# Altium project TeachEE.PrjPcb (part 2 of 2)

## Sheet ADC.SchDoc
size A4; SheetNumber: 7; SheetTotal: 9
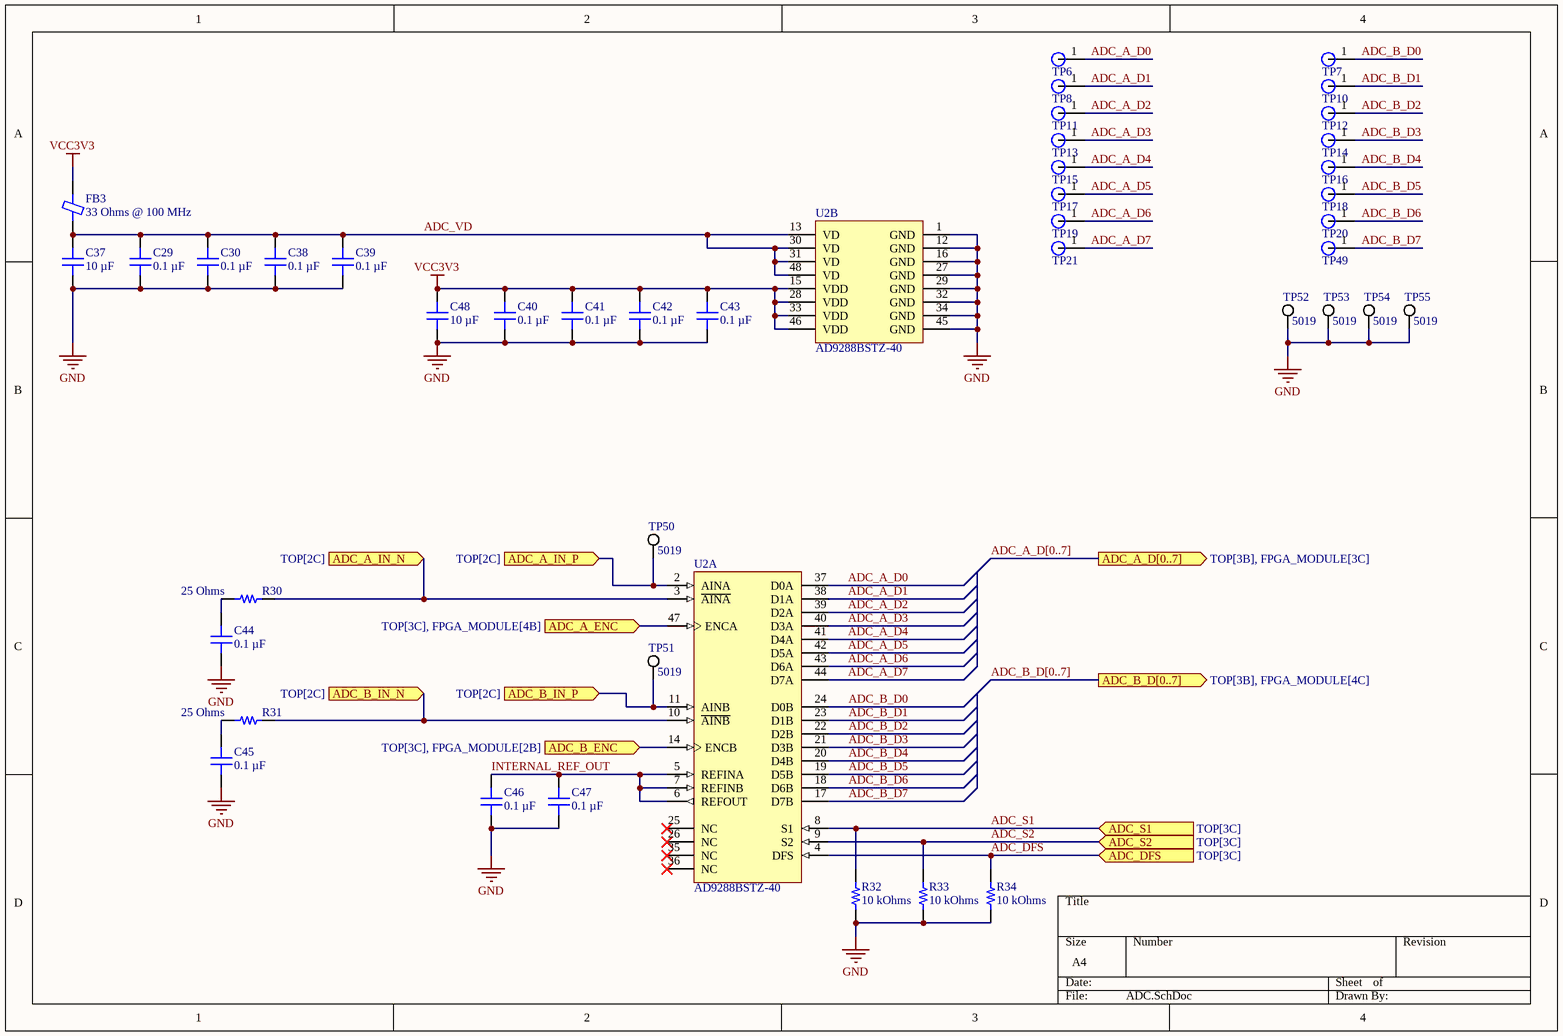
[diagram p4: ADC.SchDoc]

### Parts
C29  0.1 µF  [CAP 0402_1005]
C30  0.1 µF  [CAP 0402_1005]
C37  10 µF  [CAP 0402_1005]
C38  0.1 µF  [CAP 0402_1005]
C39  0.1 µF  [CAP 0402_1005]
C40  0.1 µF  [CAP 0402_1005]
C41  0.1 µF  [CAP 0402_1005]
C42  0.1 µF  [CAP 0402_1005]
C43  0.1 µF  [CAP 0402_1005]
C44  0.1 µF  [CAP 0402_1005]
C45  0.1 µF  [CAP 0402_1005]
C46  0.1 µF  [CAP 0402_1005]
C47  0.1 µF  [CAP 0402_1005]
C48  10 µF  [CAP 0402_1005]
FB3  33 Ohms @ 100 MHz  [FER 0201_0603]
R30  25 Ohms  [RES 0402_1005]
R31  25 Ohms  [RES 0402_1005]
R32  10 kOhms  [RES 0402_1005]
R33  10 kOhms  [RES 0402_1005]
R34  10 kOhms  [RES 0402_1005]
TP6  Test Point  [TP1]  (value not drawn)  (no BOM)
TP7  Test Point  [TP1]  (value not drawn)  (no BOM)
TP8  Test Point  [TP1]  (value not drawn)  (no BOM)
TP10  Test Point  [TP1]  (value not drawn)  (no BOM)
TP11  Test Point  [TP1]  (value not drawn)  (no BOM)
TP12  Test Point  [TP1]  (value not drawn)  (no BOM)
TP13  Test Point  [TP1]  (value not drawn)  (no BOM)
TP14  Test Point  [TP1]  (value not drawn)  (no BOM)
TP15  Test Point  [TP1]  (value not drawn)  (no BOM)
TP16  Test Point  [TP1]  (value not drawn)  (no BOM)
TP17  Test Point  [TP1]  (value not drawn)  (no BOM)
TP18  Test Point  [TP1]  (value not drawn)  (no BOM)
TP19  Test Point  [TP1]  (value not drawn)  (no BOM)
TP20  Test Point  [TP1]  (value not drawn)  (no BOM)
TP21  Test Point  [TP1]  (value not drawn)  (no BOM)
TP49  Test Point  [TP1]  (value not drawn)  (no BOM)
TP50  5019  [KSTN-5019_V]
TP51  5019  [KSTN-5019_V]
TP52  5019  [KSTN-5019_V]
TP53  5019  [KSTN-5019_V]
TP54  5019  [KSTN-5019_V]
TP55  5019  [KSTN-5019_V]
U2  AD9288BSTZ-40  [ST-48_M]  (parts A,B of 2)

### Ports
ADC_A_D[0..7] (out, see TOP[3B], FPGA_MODULE[3C]), ADC_A_ENC (in, see TOP[3C], FPGA_MODULE[4B]), ADC_A_IN_N (in, see TOP[2C]), ADC_A_IN_P (in, see TOP[2C]), ADC_B_D[0..7] (out, see TOP[3B], FPGA_MODULE[4C]), ADC_B_ENC (in, see TOP[3C], FPGA_MODULE[2B]), ADC_B_IN_N (in, see TOP[2C]), ADC_B_IN_P (in, see TOP[2C]), ADC_DFS (in, see TOP[3C]), ADC_S1 (in, see TOP[3C]), ADC_S2 (in, see TOP[3C])

### Nets
GND: C29.1 C30.1 C37.1 C38.1 C39.1 C40.1 C41.1 C42.1 C43.1 C44.1 C45.1 C46.1 C47.1 C48.1 R32.1 R33.1 R34.1 TP52.1 TP53.1 TP54.1 TP55.1 U2.1(GND) U2.12(GND) U2.16(GND) U2.27(GND) U2.29(GND) U2.32(GND) U2.34(GND) U2.45(GND)
VCC3V3: C40.2 C41.2 C42.2 C43.2 C48.2 FB3.1 U2.15(VDD) U2.28(VDD) U2.33(VDD) U2.46(VDD)
ADC_A_D0: TP6.1 U2.37(D0A)
ADC_A_D1: TP8.1 U2.38(D1A)
ADC_A_D2: TP11.1 U2.39(D2A)
ADC_A_D3: TP13.1 U2.40(D3A)
ADC_A_D4: TP15.1 U2.41(D4A)
ADC_A_D5: TP17.1 U2.42(D5A)
ADC_A_D6: TP19.1 U2.43(D6A)
ADC_A_D7: TP21.1 U2.44(D7A)
ADC_A_ENC: U2.47(ENCA) ; port ADC_A_ENC
ADC_A_IN_N: R30.2 U2.3(~{AINA}) ; port ADC_A_IN_N
ADC_A_IN_P: TP50.1 U2.2(AINA) ; port ADC_A_IN_P
ADC_B_D0: TP7.1 U2.24(D0B)
ADC_B_D1: TP10.1 U2.23(D1B)
ADC_B_D2: TP12.1 U2.22(D2B)
ADC_B_D3: TP14.1 U2.21(D3B)
ADC_B_D4: TP16.1 U2.20(D4B)
ADC_B_D5: TP18.1 U2.19(D5B)
ADC_B_D6: TP20.1 U2.18(D6B)
ADC_B_D7: TP49.1 U2.17(D7B)
ADC_B_ENC: U2.14(ENCB) ; port ADC_B_ENC
ADC_B_IN_N: R31.2 U2.10(~{AINB}) ; port ADC_B_IN_N
ADC_B_IN_P: TP51.1 U2.11(AINB) ; port ADC_B_IN_P
ADC_DFS: R34.2 U2.4(DFS) ; port ADC_DFS
ADC_S1: R32.2 U2.8(S1) ; port ADC_S1
ADC_S2: R33.2 U2.9(S2) ; port ADC_S2
ADC_VD: C29.2 C30.2 C37.2 C38.2 C39.2 FB3.2 U2.13(VD) U2.30(VD) U2.31(VD) U2.48(VD)
INTERNAL_REF_OUT: C46.2 C47.2 U2.5(REFINA) U2.6(REFOUT) U2.7(REFINB)
NetC44_2: C44.2 R30.1
NetC45_2: C45.2 R31.1

Not connected (* = marked no-connect by the designer): U2 25(NC)* 26(NC)* 35(NC)* 36(NC)*

### Buses and harness runs
bus ADC_A_D[0..7] = port ADC_A_D[0..7]
bus ADC_B_D[0..7] = port ADC_B_D[0..7]

### Library data of the parts
C29 C30 C38-C47 = CGA2B3X5R1H104M050BB: CAP CER 0.1UF 50V X5R 0402; manufacturer: TDK Corporation; Tolerance: ±20%; Part Number: CGA2B3X5R1H104M050BB; Value: 0.1 µF; Applications: Automotive; Capacitance: 0.1 µF; componentlink1description: Datasheet; componentlink1url: https://product.tdk.com/info/en/catalog/datasheets/mlcc_automotive_general_en.pdf?ref_disty=digikey; componentlink2description: DigiKey Link; componentlink2url: https://www.digikey.com/en/products/detail/tdk-corporation/CGA2B3X5R1H104M050BB/3949450; Device Package: 0402 (1005 Metric); lastupdated: 2022-07-21 3:55:54 AM; Lifecycle Status: Active; Minimum Order: 1; Mounting Type: Surface Mount, MLCC; Operating Temperature: -55°C ~ 85°C; Package / Case: 0402 (1005 Metric); packaging: TapeAndReel; partid: 1792; Part Status: Active; price: 0.02; Ratings: AEC-Q200; series: CGA; Size / Dimension: 0.039" L x 0.020" W (1.00mm x 0.50mm); Supplier 1: DigiKey; Supplier Part Number 1: 445-12214-1-ND; Temperature Coefficient: X5R; Thickness (Max): 0.022" (0.55mm); Voltage - Rated: 50V
C37 C48 = CL05A106MP8NUB8: CAP CER 10UF 10V X5R 0402; manufacturer: Samsung Electro-Mechanics; Tolerance: ±20%; Part Number: CL05A106MP8NUB8; Value: 10 µF; Applications: General Purpose; Capacitance: 10 µF; componentlink1description: Datasheet; componentlink1url: http://www.samsungsem.com/kr/support/product-search/mlcc/CL05A106MP8NUB8.jsp; componentlink2description: DigiKey Link; componentlink2url: https://www.digikey.com/en/products/detail/samsung-electro-mechanics/CL05A106MP8NUB8/5961314; Device Package: 0402 (1005 Metric); lastupdated: 2022-07-15 11:25:56 AM; Lifecycle Status: Active; Minimum Order: 1; Mounting Type: Surface Mount, MLCC; Operating Temperature: -55°C ~ 85°C; Package / Case: 0402 (1005 Metric); packaging: TapeAndReel; partid: 1758; Part Status: Active; price: 0.07; series: CL; Size / Dimension: 0.039" L x 0.020" W (1.00mm x 0.50mm); Supplier 1: DigiKey; Supplier Part Number 1: 1276-6830-1-ND; Temperature Coefficient: X5R; Thickness (Max): 0.035" (0.90mm); Voltage - Rated: 10V
FB3 = MMZ0603F330CT000: FERRITE BEAD 33 OHM 0201 1LN; Manufacturer: TDK Corporation; Current Rating (Max): 150mA; DC Resistance (DCR) (Max): 1.3Ohm; Filter Type: Signal Line; Number of Lines: 1; Part Number: MMZ0603F330CT000; ComponentLink1Description: Datasheet; ComponentLink1URL: https://product.tdk.com/info/en/catalog/datasheets/beads_commercial_signal_mmz0603_en.pdf?ref_disty=digikey; ComponentLink2Description: DigiKey Link; ComponentLink2URL: https://www.digikey.com/en/products/detail/tdk-corporation/MMZ0603F330CT000/2747662; Device Package: 0201 (0603 Metric); Height (Max): 0.013" (0.33mm); Impedance @ Frequency: 33 Ohms @ 100 MHz; LastUpdated: 2022-07-21 4:37:41 AM; Lifecycle Status: Active; Minimum Order: 1; Mounting Type: Surface Mount; Operating Temperature: -55°C ~ 125°C; Package / Case: 0201 (0603 Metric); Packaging: TapeAndReel; PartId: 1; Part Status: Active; Price: 0.03; Series: MMZ; Size / Dimension: 0.024" L x 0.012" W (0.60mm x 0.30mm); Supplier 1: DigiKey; Supplier Part Number 1: 445-7792-1-ND; Value: 33 Ohms @ 100 MHz
R30 R31 = FC0402E25R0BST0: RES 25 OHM 0.1% 1/20W 0402; Manufacturer: Vishay Thin Film; Power (Watts): 0.05W, 1/20W; Temperature Coefficient: ±25ppm/°C; Part Number: FC0402E25R0BST0; Value: 25 Ohms; ComponentLink1Description: Datasheet; ComponentLink1URL: http://www.vishay.com/docs/60093/fcseries.pdf; ComponentLink2Description: DigiKey Link; ComponentLink2URL: http://digikey.com/product-detail/en/vishay-thin-film/FC0402E25R0BST0/764-1327-1-ND/7103111; Composition: Thin Film; Device Package: 0402 (1005 Metric); Features: RF, High Frequency; Height - Seated (Max): 0.015" (0.38mm); LastUpdated: 2022-09-18 12:21:41 PM; Lifecycle Status: Active; Minimum Order: 1; Number of Terminations: 2; Operating Temperature: -55°C ~ 155°C; Package / Case: 0402 (1005 Metric); Packaging: TapeAndReel; PartId: 11457; Part Status: Active; Price: 2.00; Resistance: 25 Ohms; Series: FC; Size / Dimension: 0.042" L x 0.022" W (1.07mm x 0.56mm); Supplier 1: DigiKey; Supplier Part Number 1: 764-1327-1-ND; Supplier Device Package: 0402; Tolerance: ±0.1%
R32-R34 = RP73PF1E10KBTD: RES 10K OHM 0.1% 1/10W 0402; Manufacturer: TE Connectivity Passive Product; Power (Watts): 0.1W, 1/10W; Temperature Coefficient: ±25ppm/°C; Part Number: RP73PF1E10KBTD; Value: 10 kOhms; ComponentLink1Description: Datasheet; ComponentLink1URL: https://www.te.com/commerce/DocumentDelivery/DDEController?Action=srchrtrv&DocNm=1773272&DocType=DS&DocLang=English; ComponentLink2Description: DigiKey Link; ComponentLink2URL: https://www.digikey.com/en/products/detail/te-connectivity-passive-product/RP73PF1E10KBTD/8260957; Composition: Thin Film; Device Package: 0402 (1005 Metric); Height - Seated (Max): 0.014" (0.35mm); LastUpdated: 2022-07-15 11:43:14 AM; Lifecycle Status: Active; Minimum Order: 1; Number of Terminations: 2; Operating Temperature: -55°C ~ 155°C; Package / Case: 0402 (1005 Metric); Packaging: TapeAndReel; PartId: 2434; Part Status: Active; Price: 0.09; Resistance: 10 kOhms; Series: RP73, Holsworthy; Size / Dimension: 0.039" L x 0.020" W (1.00mm x 0.50mm); Supplier 1: DigiKey; Supplier Part Number 1: A127415CT-ND; Supplier Device Package: 0402; Tolerance: ±0.1%
TP6-TP8 TP10-TP21 TP49 = TP1
TP50-TP55 = CMP-1672-00008-1: Test Point, 1 Position SMD, RoHS, Tape and Reel; ComponentLink1Description: Manufacturer URL; Package Quantity: 1000; DatasheetVersion: 03/2014; Packaging: Tape and Reel; ComponentLink2URL: http://www.keyelco.com/product-pdf.cfm?p=1357; ComponentLink1URL: http://www.keyelco.com/; Mount: Surface Mount; Contact Plating: Silver; PackageDescription: 1-Pin Surface Mount Device, Body 3.81 x 2.03 mm; Pins: 1; RoHSCompliant: True; Mounting Technology: Surface Mount; ComponentLink2Description: Datasheet; PackageReference: 5019
U2 = CMP-0313-02378-2: Dual 8-Bit Analog-to-Digital Converter with Parallel Interface, 40MSPS, -40 to +85 degC, ST-48, Pb-Free, Tray; Generic Part Number: AD9288-40; Manufacturer: Analog Devices; Resolution (Bits): 8; Channels: 2; Interface: Par; Throughput Rate (SPS): 40M; PackageReference: ST-48; ComponentLink1Description: Manufacturer URL; PackageVersion: revA; ComponentLink2Description: Datasheet; Mounting Technology: Surface Mount; RoHS: Y; Packing: Tray; PartNumber: AD9288BSTZ-40; ComponentLink3Description: Package Specification; DatasheetVersion: Rev.C; PackageDescription: 48-Pin Thin Quad Flat Pack 0.5 mm Pitch; ComponentLink2URL: http://www.analog.com/static/imported-files/data_sheets/AD9288.pdf; ComponentLink3URL: http://www.analog.com/static/imported-files/packages/PKG_PDF/LQFP%28ST%29/ST_48.pdf; ComponentLink4URL: http://www.analog.com/en/analog-to-digital-converters/ad-converters/ad9288/products/product.html; ComponentLink1URL: http://www.analog.com/en/index.html; ComponentLink4Description: Product URL

## Sheet POWER.SchDoc
size A4; SheetNumber: 4; SheetTotal: 7
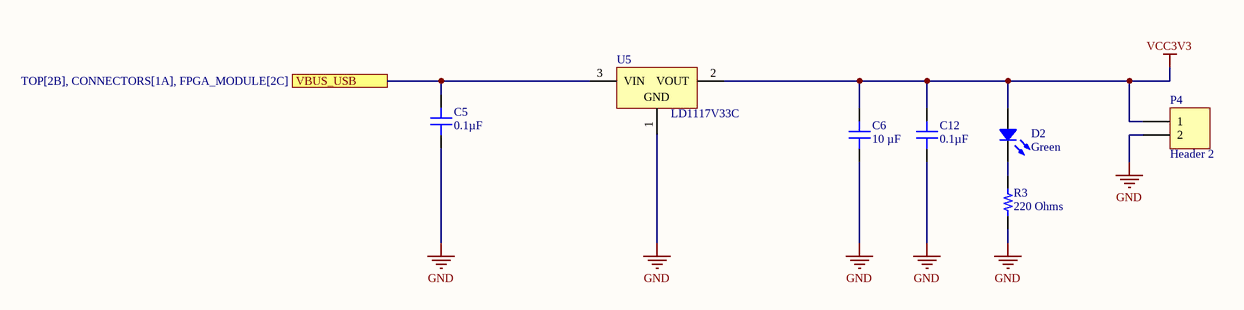
[diagram p5: POWER.SchDoc]

### Parts
C5  0.1µF  [CAP 0402_1005]
C6  10 µF  [CAP 1206_3216 - 0.8MM]
C12  0.1µF  [CAP 0402_1005]
D2  Green  [LED 1206_3216 GREEN]
P4  Header 2  [HDR1X2]
R3  220 Ohms  [RES 0402_1005]
U5  LD1117V33C  [TO220]

### Ports
VBUS_USB (see TOP[2B], CONNECTORS[1A], FPGA_MODULE[2C])

### Nets
GND: C5.1 C6.1 C12.1 P4.2 R3.1 U5.1(GND)
VCC3V3: C6.2 C12.2 D2.1 P4.1 U5.2(VOUT)
VBUS_USB: C5.2 U5.3(VIN) ; port VBUS_USB
NetD2_2: D2.2 R3.2

### Library data of the parts
C5 C12 = 0402ZC104KAT2A: CAP CER 0.1UF 10V X7R 0402; manufacturer: AVX Corporation; Tolerance: ±10%; Part Number: 0402ZC104KAT2A; Value: 0.1µF; Applications: General Purpose; Capacitance: 0.1µF; componentlink1description: Datasheet; componentlink1url: http://datasheets.avx.com/X7RDielectric.pdf; componentlink2description: DigiKey Link; componentlink2url: http://digikey.com/product-detail/en/avx-corporation/0402ZC104KAT2A/478-7891-1-ND/3881514; Device Package: 0402 (1005 Metric); lastupdated: 2022-02-08 12:26:59 PM; Lifecycle Status: Active; Minimum Order: 1; Mounting Type: Surface Mount, MLCC; Operating Temperature: -55°C ~ 125°C; Package / Case: 0402 (1005 Metric); packaging: TapeAndReel; partid: 1757; Part Status: Active; price: 0.09; series: -; Size / Dimension: 0.039" L x 0.020" W (1.00mm x 0.50mm); Supplier 1: DigiKey; Supplier Part Number 1: 478-7891-1-ND; Temperature Coefficient: X7R; Thickness (Max): 0.022" (0.55mm); Voltage - Rated: 10V
C6 = EMK316BJ106MD-T: CAP CER 10UF 16V X5R 1206; manufacturer: Taiyo Yuden; Tolerance: ±20%; Part Number: EMK316BJ106MD-T; Value: 10 µF; Applications: SMPS Filtering; Capacitance: 10 µF; componentlink1description: Datasheet; componentlink1url: http://www.yuden.co.jp/productdata/catalog/mlcc06_e.pdf; componentlink2description: DigiKey Link; componentlink2url: https://www.digikey.com/en/products/detail/taiyo-yuden/EMK316BJ106MD-T/6563474; Device Package: 1206 (3216 Metric); lastupdated: 2022-07-15 11:34:50 AM; Lifecycle Status: Active; Minimum Order: 1; Mounting Type: Surface Mount, MLCC; Operating Temperature: -55°C ~ 85°C; Package / Case: 1206 (3216 Metric); packaging: TapeAndReel; partid: 18996; Part Status: Active; price: 0.07; series: M; Size / Dimension: 0.126" L x 0.063" W (3.20mm x 1.60mm); Supplier 1: DigiKey; Supplier Part Number 1: 587-4881-1-ND; Temperature Coefficient: X5R; Thickness (Max): 0.037" (0.95mm); Voltage - Rated: 16V
D2 = APTL3216ZGCK-01: LED SMD; Manufacturer: Kingbright; Configuration: 1206; Current - Test: 20mA; Lens Color: Colorless; Lens Size: 1.10mm Dia; Lens Style: Round with Domed Top; Lens Transparency: Clear; Millicandela Rating: 1000mcd; Viewing Angle: 80°; Voltage - Forward (Vf) (Typ): 3.3V; Wavelength - Dominant: 525nm; Wavelength - Peak: 515nm; Part Number: APTL3216ZGCK-01; Color: Green; ComponentLink1Description: Datasheet; ComponentLink1URL: http://www.kingbrightusa.com/images/catalog/SPEC/APTL3216ZGCK-01.pdf; ComponentLink2Description: DigiKey Link; ComponentLink2URL: https://www.digikey.com/en/products/detail/kingbright/APTL3216ZGCK-01/10293089; Device Package: 1206 (3216 Metric); Height (Max): 1.20mm; LastUpdated: 2022-07-15 12:08:33 PM; Lifecycle Status: Active; Minimum Order: 1; Mounting Type: Surface Mount; Package / Case: 1206 (3216 Metric); Packaging: TapeAndReel; PartId: 546; Part Status: Active; Price: 0.18; Series: Heli-R; Size / Dimension: 3.20mm L x 1.60mm W; Supplier 1: DigiKey; Supplier Part Number 1: 754-APTL3216ZGCK-01CT-ND; Supplier Device Package: 1206; Value: Green
P4 = Header 2: Header, 2-Pin; LatestRevisionDate: 17-Jul-2002; LatestRevisionNote: Re-released for DXP Platform.; Publisher: Altium Limited
R3 = CRGP0402F220R: RES 220 OHM 1% 1/8W 0402; Manufacturer: TE Connectivity Passive Product; Power (Watts): 0.125W, 1/8W; Temperature Coefficient: ±100ppm/°C; Part Number: CRGP0402F220R; Value: 220 Ohms; ComponentLink1Description: Datasheet; ComponentLink1URL: https://www.te.com/commerce/DocumentDelivery/DDEController?Action=srchrtrv&DocNm=9-1773463-9&DocType=DS&DocLang=English; ComponentLink2Description: DigiKey Link; ComponentLink2URL: https://www.digikey.com/en/products/detail/te-connectivity-passive-product/CRGP0402F220R/8576949; Composition: Thick Film; Device Package: 0402 (1005 Metric); Features: Pulse Withstanding; Height - Seated (Max): 0.016" (0.40mm); LastUpdated: 2022-07-15 11:43:01 AM; Lifecycle Status: Active; Minimum Order: 1; Number of Terminations: 2; Operating Temperature: -55°C ~ 155°C; Package / Case: 0402 (1005 Metric); Packaging: TapeAndReel; PartId: 6226; Part Status: Active; Price: 0.01; Resistance: 220 Ohms; Series: CRGP; Size / Dimension: 0.043" L x 0.020" W (1.10mm x 0.50mm); Supplier 1: DigiKey; Supplier Part Number 1: A130347CT-ND; Supplier Device Package: 0402; Tolerance: ±1%
U5 = CMP-0244-00471-1: Fixed Low Drop Positive Voltage Regulator, 3.3V, 3-Pin TO-220; ComponentLink1URL: http://www.st.com; ComponentLink1Description: Manufacturer URL; PackageDescription: TO, Thru-Hole, Vertical, Heatsink Mounted; 3 In-Line Leads; Pitch 2.54 mm; ComponentLink2URL: http://www.st.com/internet/com/TECHNICAL_RESOURCES/TECHNICAL_LITERATURE/DATASHEET/CD00000544.pdf; PackageVersion: ver3.0; ComponentLink2Description: Datasheet; ComponentLink3URL: http://www.st.com/internet/com/TECHNICAL_RESOURCES/TECHNICAL_LITERATURE/PACKAGE_INFORMATION/CD00004649.pdf; ComponentLink3Description: Package Specification; PackageReference: TO220; DatasheetVersion: 1/11/2011

## Sheet AFE_DIFF.SchDoc
size A4; SheetNumber: 8; SheetTotal: 8
Used 2 times, as channels AFE_CHANNEL_A, AFE_CHANNEL_B. Parts and nets are listed once, with the designators drawn on the sheet.
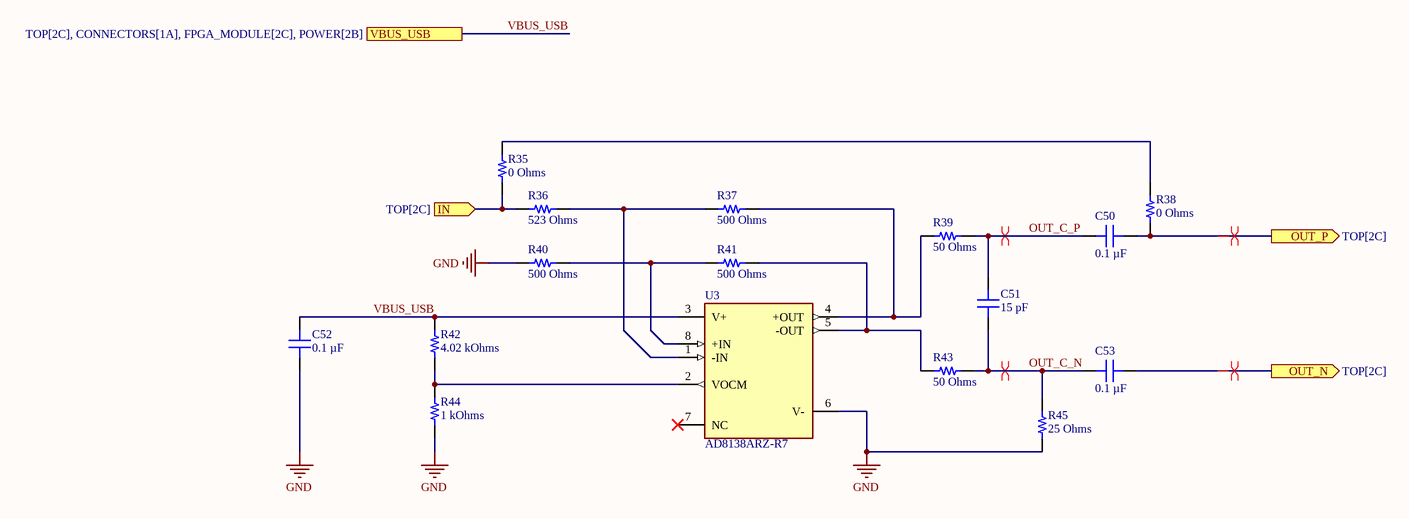
[diagram p6: AFE_DIFF.SchDoc]

### Parts
C50  0.1 µF  [CAP 0402_1005]
C51  15 pF  [CAP 0603_1608]
C52  0.1 µF  [CAP 0402_1005]
C53  0.1 µF  [CAP 0402_1005]
R35  0 Ohms  [RES 0603_1608]
R36  523 Ohms  [RES 0402_1005]
R37  500 Ohms  [RES 0603_1608]
R38  0 Ohms  [RES 0603_1608]
R39  50 Ohms  [RES 0603_1608]
R40  500 Ohms  [RES 0603_1608]
R41  500 Ohms  [RES 0603_1608]
R42  4.02 kOhms  [RES 0603_1608]
R43  50 Ohms  [RES 0603_1608]
R44  1 kOhms  [RES 0603_1608]
R45  25 Ohms  [RES 0402_1005]
U3  AD8138ARZ-R7  [FP-R-8-IPC_A]

### Ports
IN (in, see TOP[2C]), OUT_N (out, see TOP[2C]), OUT_P (out, see TOP[2C]), VBUS_USB (see TOP[2C], CONNECTORS[1A], FPGA_MODULE[2C], POWER[2B])

### Nets
GND: C52.1 R40.1 R44.1 R45.1 U3.6(V-)
IN: R35.1 R36.1 ; port IN
OUT_C_N: C51.1 C53.2 R43.2 R45.2
OUT_C_P: C50.2 C51.2 R39.2
OUT_N: C53.1 ; port OUT_N
OUT_P: C50.1 R38.1 ; port OUT_P
VBUS_USB: C52.2 R42.2 U3.3(V+) ; port VBUS_USB
NetR35_2: R35.2 R38.2
NetR36_2: R36.2 R37.1 U3.1(-IN)
NetR37_2: R37.2 R39.1 U3.4(+OUT)
NetR40_2: R40.2 R41.1 U3.8(+IN)
NetR41_2: R41.2 R43.1 U3.5(-OUT)
NetR42_1: R42.1 R44.2 U3.2(VOCM)

Not connected (* = marked no-connect by the designer): U3 7(NC)*

### Channels
AFE_CHANNEL_A: designators end in _AFE_CHANNEL_A; ports IN=SIGA OUT_N=ADC_A_IN_N OUT_P=ADC_A_IN_P VBUS_USB=VBUS_USB
AFE_CHANNEL_B: designators end in _AFE_CHANNEL_B; ports IN=SIGB OUT_N=ADC_B_IN_N OUT_P=ADC_B_IN_P VBUS_USB=VBUS_USB

### Layout directives
differential pair: ADC_A_IN_N, ADC_A_IN_P, OUT_C_N_AFE_CHANNEL_A, OUT_C_P_AFE_CHANNEL_A

### Library data of the parts
C50 C52 C53 = CGA2B3X5R1H104M050BB: as C29 on sheet ADC; Part Number: CGA2B3X5R1H104M050BB; Value: 0.1 µF; Applications: Automotive; Capacitance: 0.1 µF; componentlink1description: Datasheet; componentlink1url: https://product.tdk.com/info/en/catalog/datasheets/mlcc_automotive_general_en.pdf?ref_disty=digikey; componentlink2description: DigiKey Link; componentlink2url: https://www.digikey.com/en/products/detail/tdk-corporation/CGA2B3X5R1H104M050BB/3949450; Device Package: 0402 (1005 Metric); lastupdated: 2022-07-21 3:55:54 AM; Lifecycle Status: Active; Minimum Order: 1; Mounting Type: Surface Mount, MLCC; Operating Temperature: -55°C ~ 85°C; Package / Case: 0402 (1005 Metric); packaging: TapeAndReel; partid: 1792; Part Status: Active; price: 0.02; Ratings: AEC-Q200; series: CGA; Size / Dimension: 0.039" L x 0.020" W (1.00mm x 0.50mm); Supplier 1: DigiKey; Supplier Part Number 1: 445-12214-1-ND; Temperature Coefficient: X5R; Thickness (Max): 0.022" (0.55mm); Voltage - Rated: 50V
C51 = C0603C150J3GACAUTO: CAP CER 15PF 25V C0G/NP0 0603; manufacturer: KEMET; Temperature Coefficient: C0G, NP0; Tolerance: ±5%; Part Number: C0603C150J3GACAUTO; Value: 15 pF; Applications: Automotive; Capacitance: 15 pF; componentlink1description: Datasheet; componentlink1url: https://api.kemet.com/component-edge/download/datasheet/C0603C150J3GACAUTO.pdf; componentlink2description: DigiKey Link; componentlink2url: https://www.digikey.com/en/products/detail/kemet/C0603C150J3GACAUTO/3314855; Device Package: 0603 (1608 Metric); Features: Low ESL; lastupdated: 2022-09-19 1:01:11 PM; Lifecycle Status: Active; Minimum Order: 1; Mounting Type: Surface Mount, MLCC; Operating Temperature: -55°C ~ 125°C; Package / Case: 0603 (1608 Metric); packaging: TapeAndReel; partid: 5370; Part Status: Active; price: 0.04; Ratings: AEC-Q200; series: SMD Auto C0G; Size / Dimension: 0.063" L x 0.031" W (1.60mm x 0.80mm); Supplier 1: DigiKey; Supplier Part Number 1: 399-6858-1-ND; Thickness (Max): 0.034" (0.87mm); Voltage - Rated: 25V
R35 R38 = 5110: RES SMD 0 OHM JUMPER 1/2W 0603; Part Number: 5110; Manufacturer: Keystone Electronics; Power (Watts): 0.5W, 1/2W; Value: 0 Ohms; ComponentLink1Description: Datasheet; ComponentLink1URL: http://keyelco.com/userAssets/file/M65p54.pdf; ComponentLink2Description: DigiKey Link; ComponentLink2URL: https://www.digikey.com/en/products/detail/keystone-electronics/5110/5118870; Composition: Metal Element; Device Package: 0603 (1608 Metric); Height - Seated (Max): 0.028" (0.70mm); LastUpdated: 2022-09-14 8:08:57 AM; Lifecycle Status: Active; Minimum Order: 1; Number of Terminations: 2; Package / Case: 0603 (1608 Metric); Packaging: TapeAndReel; PartId: 20779; Part Status: Active; Price: 0.16; Resistance: 0 Ohms; Series: -; Size / Dimension: 0.061" L x 0.033" W (1.55mm x 0.85mm); Supplier 1: DigiKey; Supplier Part Number 1: 36-5110CT-ND; Supplier Device Package: 0603; Tolerance: Jumper
R36 = ERA-2ARB5230X: RES SMD 523 OHM 0.1% 1/16W 0402; Manufacturer: Panasonic Electronic Components; Power (Watts): 0.063W, 1/16W; Temperature Coefficient: ±10ppm/°C; Part Number: ERA-2ARB5230X; Value: 523 Ohms; ComponentLink1Description: Datasheet; ComponentLink1URL: https://industrial.panasonic.com/cdbs/www-data/pdf/RDM0000/AOA0000C307.pdf; ComponentLink2Description: DigiKey Link; ComponentLink2URL: https://www.digikey.com/en/products/detail/panasonic-electronic-components/ERA-2ARB5230X/5162143; Composition: Thin Film; Device Package: 0402 (1005 Metric); Features: Automotive AEC-Q200; Height - Seated (Max): 0.016" (0.40mm); LastUpdated: 2022-09-19 1:14:41 PM; Lifecycle Status: Active; Minimum Order: 1; Number of Terminations: 2; Operating Temperature: -55°C ~ 155°C; Package / Case: 0402 (1005 Metric); Packaging: TapeAndReel; PartId: 8974; Part Status: Active; Price: 0.24; Ratings: AEC-Q200; Resistance: 523 Ohms; Series: ERA-2A; Size / Dimension: 0.039" L x 0.020" W (1.00mm x 0.50mm); Supplier 1: DigiKey; Supplier Part Number 1: P18082CT-ND; Supplier Device Package: 0402; Tolerance: ±0.1%
R37 R40 R41 = TNPU0603500RAZEN00: RES SMD 500 OHM 0.05% 1/10W 0603; Manufacturer: Vishay Dale; Power (Watts): 0.1W, 1/10W; Temperature Coefficient: ±5ppm/°C; Part Number: TNPU0603500RAZEN00; Value: 500 Ohms; ComponentLink1Description: Datasheet; ComponentLink1URL: http://www.vishay.com/docs/28779/tnpue3.pdf; ComponentLink2Description: DigiKey Link; ComponentLink2URL: http://digikey.com/product-detail/en/vishay-dale/TNPU0603500RAZEN00/541-3301-1-ND/6615958; Composition: Thin Film; Device Package: 0603 (1608 Metric); Features: Anti-Sulfur, Automotive AEC-Q200, Moisture Resistant; Height - Seated (Max): 0.022" (0.55mm); LastUpdated: 2022-09-19 1:22:08 PM; Lifecycle Status: Active; Minimum Order: 1; Number of Terminations: 2; Operating Temperature: -55°C ~ 125°C; Package / Case: 0603 (1608 Metric); Packaging: TapeAndReel; PartId: 11840; Part Status: Active; Price: 1.20; Ratings: AEC-Q200; Resistance: 500 Ohms; Series: TNPU; Size / Dimension: 0.063" L x 0.033" W (1.60mm x 0.85mm); Supplier 1: DigiKey; Supplier Part Number 1: 541-3301-1-ND; Supplier Device Package: 0603; Tolerance: ±0.05%
R39 R43 = CH0603-50RJNTA: RES 50 OHM 5% 1/8W 0603; Manufacturer: Vishay Sfernice; Power (Watts): 0.125W, 1/8W; Temperature Coefficient: ±100ppm/°C; Part Number: CH0603-50RJNTA; Value: 50 Ohms; ComponentLink1Description: Datasheet; ComponentLink1URL: http://www.vishay.com/docs/53014/ch.pdf; ComponentLink2Description: DigiKey Link; ComponentLink2URL: https://www.digikey.com/en/products/detail/vishay-sfernice/CH0603-50RJNTA/9405753; Composition: Thin Film; Device Package: 0603 (1608 Metric); Features: RF, High Frequency; Height - Seated (Max): 0.025" (0.63mm); LastUpdated: 2022-09-19 1:22:06 PM; Lifecycle Status: Active; Minimum Order: 1; Number of Terminations: 2; Operating Temperature: -55°C ~ 155°C; Package / Case: 0603 (1608 Metric); Packaging: TapeAndReel; PartId: 12205; Part Status: Active; Price: 3.51; Resistance: 50 Ohms; Series: CH; Size / Dimension: 0.060" L x 0.030" W (1.52mm x 0.76mm); Supplier 1: DigiKey; Supplier Part Number 1: 716-1163-1-ND; Supplier Device Package: 0603; Tolerance: ±5%
R42 = AC0603FR-074K02L: RES SMD 4.02K OHM 1% 1/10W 0603; Manufacturer: Yageo; Power (Watts): 0.1W, 1/10W; Temperature Coefficient: ±100ppm/°C; Part Number: AC0603FR-074K02L; Value: 4.02 kOhms; ComponentLink1Description: Datasheet; ComponentLink1URL: https://www.yageo.com/upload/media/product/productsearch/datasheet/rchip/PYu-AC_51_RoHS_L_7.pdf; ComponentLink2Description: DigiKey Link; ComponentLink2URL: https://www.digikey.com/en/products/detail/yageo/AC0603FR-074K02L/5896151; Composition: Thick Film; Device Package: 0603 (1608 Metric); Features: Automotive AEC-Q200, Moisture Resistant; Height - Seated (Max): 0.022" (0.55mm); LastUpdated: 2022-09-19 1:21:09 PM; Lifecycle Status: Active; Minimum Order: 1; Number of Terminations: 2; Operating Temperature: -55°C ~ 155°C; Package / Case: 0603 (1608 Metric); Packaging: CutTape; PartId: 24892; Part Status: Active; Price: 0.01; Ratings: AEC-Q200; Resistance: 4.02 kOhms; Series: AC; Size / Dimension: 0.063" L x 0.031" W (1.60mm x 0.80mm); Supplier 1: DigiKey; Supplier Part Number 1: YAG5341CT-ND; Supplier Device Package: 0603; Tolerance: ±1%
R44 = AA0603FR-071KL: RES SMD 1K OHM 1% 1/10W 0603; Manufacturer: Yageo; Power (Watts): 0.1W, 1/10W; Temperature Coefficient: ±150ppm/°C; Part Number: AA0603FR-071KL; Value: 1 kOhms; ComponentLink1Description: Datasheet; ComponentLink1URL: https://www.yageo.com/upload/media/product/productsearch/datasheet/rchip/PYu-AA_51_RoHS_L_3.pdf; ComponentLink2Description: DigiKey Link; ComponentLink2URL: https://www.digikey.com/en/products/detail/yageo/AA0603FR-071KL/5888847; Composition: Thick Film; Device Package: 0603 (1608 Metric); Features: Anti-Sulfur, Automotive AEC-Q200, Moisture Resistant; Height - Seated (Max): 0.022" (0.55mm); LastUpdated: 2022-09-19 1:20:47 PM; Lifecycle Status: Active; Minimum Order: 1; Number of Terminations: 2; Operating Temperature: -55°C ~ 155°C; Package / Case: 0603 (1608 Metric); Packaging: TapeAndReel; PartId: 64335; Part Status: Active; Price: 0.01; Ratings: AEC-Q200; Resistance: 1 kOhms; Series: AA; Size / Dimension: 0.063" L x 0.031" W (1.60mm x 0.80mm); Supplier 1: DigiKey; Supplier Part Number 1: 13-AA0603FR-071KLCT-ND; Supplier Device Package: 0603; Tolerance: ±1%
R45 = FC0402E25R0BST0: as R30 on sheet ADC; Part Number: FC0402E25R0BST0; Value: 25 Ohms; ComponentLink1Description: Datasheet; ComponentLink1URL: http://www.vishay.com/docs/60093/fcseries.pdf; ComponentLink2Description: DigiKey Link; ComponentLink2URL: http://digikey.com/product-detail/en/vishay-thin-film/FC0402E25R0BST0/764-1327-1-ND/7103111; Composition: Thin Film; Device Package: 0402 (1005 Metric); Features: RF, High Frequency; Height - Seated (Max): 0.015" (0.38mm); LastUpdated: 2022-09-19 1:14:33 PM; Lifecycle Status: Active; Minimum Order: 1; Number of Terminations: 2; Operating Temperature: -55°C ~ 155°C; Package / Case: 0402 (1005 Metric); Packaging: TapeAndReel; PartId: 11457; Part Status: Active; Price: 2.00; Resistance: 25 Ohms; Series: FC; Size / Dimension: 0.042" L x 0.022" W (1.07mm x 0.56mm); Supplier 1: DigiKey; Supplier Part Number 1: 764-1327-1-ND; Supplier Device Package: 0402; Tolerance: ±0.1%
U3 = CMP-09081-000074-1: IC ADC DRIVER 8SOIC; Input Offset Voltage (Vos): 1mV; Voltage Gain: 0.028dB; Operating Supply Current: 20mA; Number of Channels: 1; Max Power Dissipation: 550mW; Input Bias Current: 7uA; Input Resistance: 6MR; -3db Bandwidth: 320MHz; Slew Rate: 1150V/µs; Min Supply Voltage: 2.7V; Operating Supply Voltage: 9V; Max Supply Voltage: 11V; Min Dual Supply Voltage: 1.4V; Common Mode Rejection Ratio: 70dB; Max Dual Supply Voltage: 5.5V; Lead Free: Contains Lead; Radiation Hardening: No; Mount: Surface Mount; Nominal Supply Current: 20mA; Package Quantity: 1000; Case/Package: SOIC; Series: -; Min Operating Temperature: -40°C; Packaging: Tape and Reel; Bandwidth: 320MHz; Number of Elements: 1; Power Dissipation: 550mW; Number of Pins: 8; RoHS Compliant: Yes; Gain Bandwidth Product: 320MHz; Number of Circuits: 1; Power Supply Rejection Ratio (PSRR): 70dB; Supply Current: 20mA; Max Operating Temperature: 85°C

## Sheet CURRENT_MONITOR.SchDoc
size A4; SheetNumber: 7; SheetTotal: 8
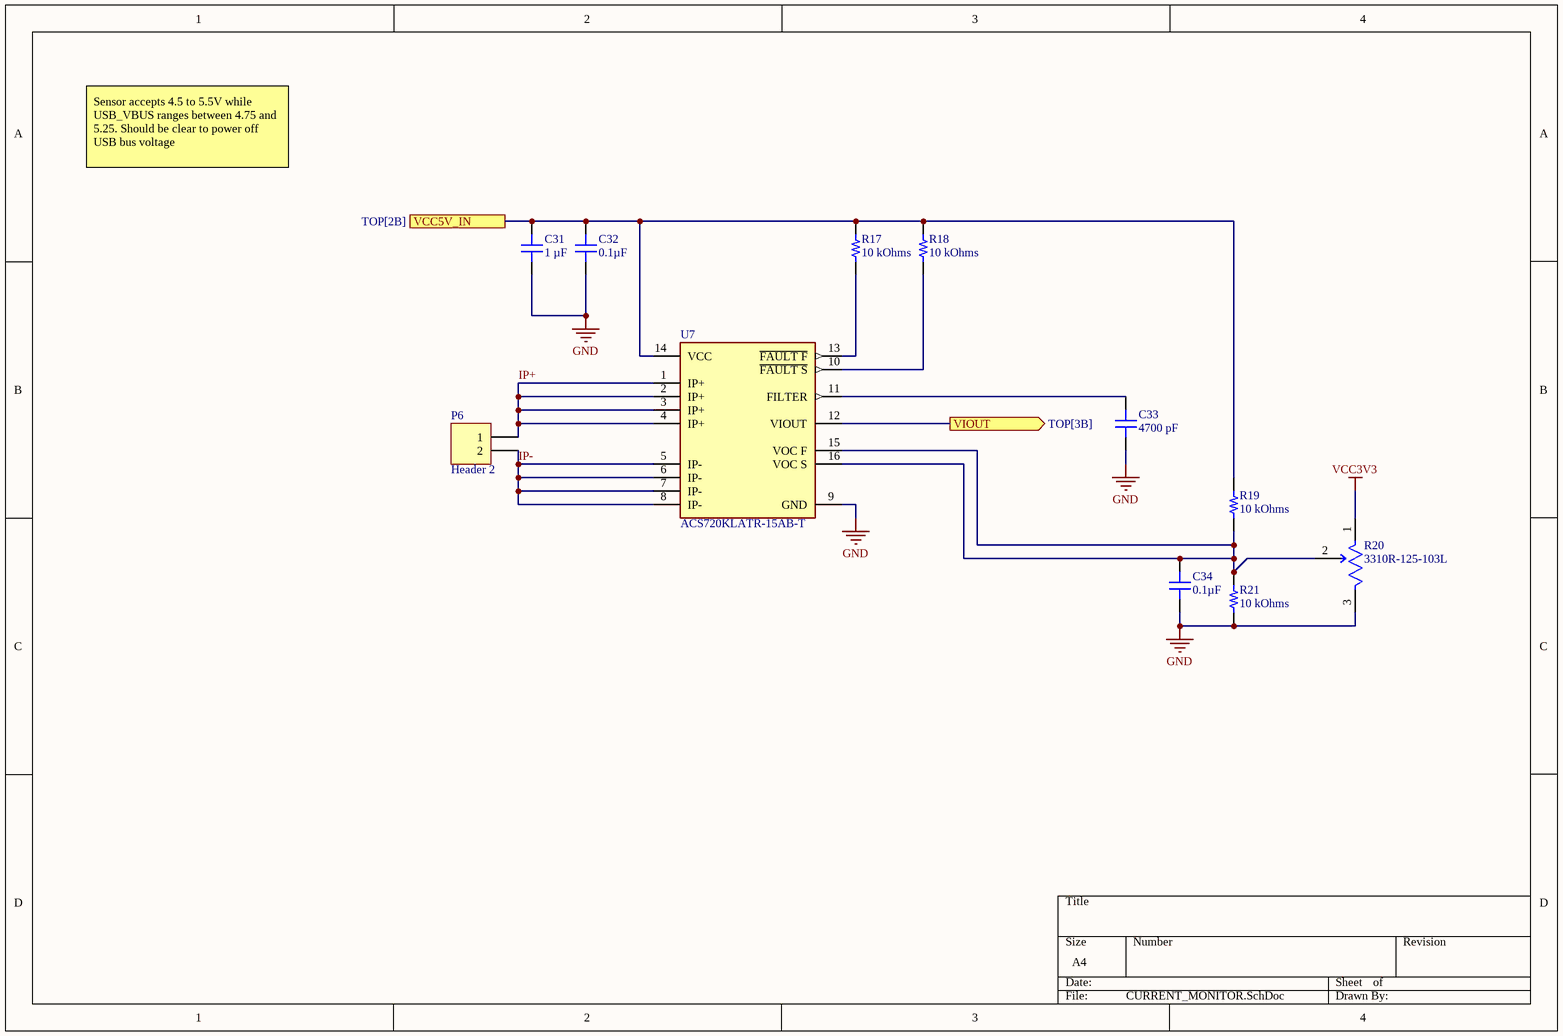
[diagram p7: CURRENT_MONITOR.SchDoc]

### Parts
C31  1 µF  [CAP 0603_1608]
C32  0.1µF  [CAP 0402_1005]
C33  4700 pF  [CAP 0603_1608]
C34  0.1µF  [CAP 0402_1005]
P6  Header 2  [HDR1X2]
R17  10 kOhms  [RES 0402_1005]
R18  10 kOhms  [RES 0402_1005]
R19  10 kOhms  [RES 0402_1005]
R20  3310R-125-103L  [FP-3310R-MFG]
R21  10 kOhms  [RES 0402_1005]
U7  ACS720KLATR-15AB-T  [FP-LA-16-IPC_A]

### Ports
VCC5V_IN (see TOP[2B]), VIOUT (out, see TOP[3B])

### Nets
GND: C31.1 C32.1 C33.1 C34.1 R20.3(CW) R21.1 U7.9(GND)
VCC3V3: R20.1(CCW)
FPGA_ADC0: U7.12(VIOUT) ; port VIOUT
IP+: P6.1 U7.1(IP+) U7.2(IP+) U7.3(IP+) U7.4(IP+)
IP-: P6.2 U7.5(IP-) U7.6(IP-) U7.7(IP-) U7.8(IP-)
VBUS_USB: C31.2 C32.2 R17.2 R18.2 R19.2 U7.14(VCC) ; port VCC5V_IN
NetC33_2: C33.2 U7.11(FILTER)
NetC34_2: C34.2 R19.1 R20.2 R21.2 U7.15(VOC_F) U7.16(VOC_S)
NetR17_1: R17.1 U7.13(~{FAULT_F})
NetR18_1: R18.1 U7.10(~{FAULT_S})

### Notes on the sheet
- Sensor accepts 4.5 to 5.5V while USB_VBUS ranges between 4.75 and 5.25. Should be clear to power off USB bus voltage

### Library data of the parts
C31 = C0603C105K4RACAUTO: CAP CER 1UF 16V X7R 0603; manufacturer: KEMET; Tolerance: ±10%; Part Number: C0603C105K4RACAUTO; Value: 1 µF; Applications: Automotive, Bypass, Decoupling; Capacitance: 1 µF; componentlink1description: Datasheet; componentlink1url: https://api.kemet.com/component-edge/download/datasheet/C0603C105K4RACAUTO.pdf; componentlink2description: DigiKey Link; componentlink2url: https://www.digikey.com/en/products/detail/kemet/C0603C105K4RACAUTO/8635831; Device Package: 0603 (1608 Metric); lastupdated: 2022-09-18 12:11:25 PM; Lifecycle Status: Active; Minimum Order: 1; Mounting Type: Surface Mount, MLCC; Operating Temperature: -55°C ~ 125°C; Package / Case: 0603 (1608 Metric); packaging: CutTape; partid: 2179; Part Status: Active; price: 0.03; Ratings: AEC-Q200; series: SMD Auto X7R; Size / Dimension: 0.063" L x 0.031" W (1.60mm x 0.80mm); Supplier 1: DigiKey; Supplier Part Number 1: 399-17704-2-ND; Temperature Coefficient: X7R; Thickness (Max): 0.037" (0.95mm); Voltage - Rated: 16V
C32 C34 = 0402ZC104KAT2A: as C5 on sheet POWER; Part Number: 0402ZC104KAT2A; Value: 0.1µF; Applications: General Purpose; Capacitance: 0.1µF; componentlink1description: Datasheet; componentlink1url: http://datasheets.avx.com/X7RDielectric.pdf; componentlink2description: DigiKey Link; componentlink2url: http://digikey.com/product-detail/en/avx-corporation/0402ZC104KAT2A/478-7891-1-ND/3881514; Device Package: 0402 (1005 Metric); lastupdated: 2022-02-08 12:26:59 PM; Lifecycle Status: Active; Minimum Order: 1; Mounting Type: Surface Mount, MLCC; Operating Temperature: -55°C ~ 125°C; Package / Case: 0402 (1005 Metric); packaging: TapeAndReel; partid: 1757; Part Status: Active; price: 0.09; series: -; Size / Dimension: 0.039" L x 0.020" W (1.00mm x 0.50mm); Supplier 1: DigiKey; Supplier Part Number 1: 478-7891-1-ND; Temperature Coefficient: X7R; Thickness (Max): 0.022" (0.55mm); Voltage - Rated: 10V
C33 = C0603C472K4RECAUTO: CAP CER 0603 4.7NF 16V X7R 10%; manufacturer: KEMET; Part Number: C0603C472K4RECAUTO; Value: 4700 pF; Applications: Automotive, ESD Protection; Capacitance: 4700 pF; componentlink1description: Datasheet; componentlink1url: https://api.kemet.com/component-edge/download/datasheet/C0603C472K4RECAUTO.pdf; componentlink2description: DigiKey Link; componentlink2url: https://www.digikey.com/en/products/detail/kemet/C0603C472K4RECAUTO/8640473; Device Package: 0603 (1608 Metric); lastupdated: 2022-09-18 12:10:47 PM; Lifecycle Status: Active; Minimum Order: 1; Mounting Type: Surface Mount, MLCC; Operating Temperature: -55°C ~ 125°C; Package / Case: 0603 (1608 Metric); packaging: TapeAndReel; partid: 17340; Part Status: Active; price: 0.02; Ratings: AEC-Q200; series: ESD SMD Auto X7R; Size / Dimension: 0.063" L x 0.031" W (1.60mm x 0.80mm); Supplier 1: DigiKey; Supplier Part Number 1: 399-17879-1-ND; Temperature Coefficient: X7R; Thickness (Max): 0.034" (0.87mm); Tolerance: ±10%; Voltage - Rated: 16V
P6 = Header 2: Header, 2-Pin; LatestRevisionDate: 17-Jul-2002; LatestRevisionNote: Re-released for DXP Platform.; Publisher: Altium Limited
R17-R19 R21 = RP73PF1E10KBTD: as R32 on sheet ADC; Part Number: RP73PF1E10KBTD; Value: 10 kOhms; ComponentLink1Description: Datasheet; ComponentLink1URL: https://www.te.com/commerce/DocumentDelivery/DDEController?Action=srchrtrv&DocNm=1773272&DocType=DS&DocLang=English; ComponentLink2Description: DigiKey Link; ComponentLink2URL: https://www.digikey.com/en/products/detail/te-connectivity-passive-product/RP73PF1E10KBTD/8260957; Composition: Thin Film; Device Package: 0402 (1005 Metric); Height - Seated (Max): 0.014" (0.35mm); LastUpdated: 2022-07-15 11:43:14 AM; Lifecycle Status: Active; Minimum Order: 1; Number of Terminations: 2; Operating Temperature: -55°C ~ 155°C; Package / Case: 0402 (1005 Metric); Packaging: TapeAndReel; PartId: 2434; Part Status: Active; Price: 0.09; Resistance: 10 kOhms; Series: RP73, Holsworthy; Size / Dimension: 0.039" L x 0.020" W (1.00mm x 0.50mm); Supplier 1: DigiKey; Supplier Part Number 1: A127415CT-ND; Supplier Device Package: 0402; Tolerance: ±0.1%
R20 = CMP-07234-000023-1: POT 10K OHM 1/4W PLASTIC LINEAR; Resistance: 10kR; Max Power Dissipation: 250mW; Temperature Coefficient: 1000ppm/°C; Actuator Length: 0.22inch; Tolerance: 20%; Actuator Diameter: 0.125inch; Number of Turns: 1; Type: Potentiometer; Taper: Linear; Max Operating Temperature: 125°C; Package Quantity: 50; Packaging: Bulk; Composition: Conductive Plastic; REACH SVHC: No SVHC; Contact Plating: Tin; Number of Gangs: 1; Weight: 4.5g; Mount: Through Hole; Min Operating Temperature: -40°C; Termination: Pin; Power Rating: 250mW
U7 = CMP-82923-000050-1: CURRENT SENSOR; Response Time: 4us; Sensitivity: 90mV/A; Number of Channels: 1; Polarity: Bidirectional; Linearity: 0.75%; Current Sensing: 15A; Frequency: 120kHz; Accuracy: 1.6%; Max Supply Current: 16mA; Mount: Surface Mount; RoHS Compliant: Yes; Min Operating Temperature: -40°C; Case/Package: SOIC; Number of Pins: 16; Max Operating Temperature: 125°C; Packaging: Cut Tape

## Nets that join several sheets
GND: TOP (7 pins), USB_FIFO (32 pins), FPGA_MODULE (11 pins), CONNECTORS (31 pins), ADC (29 pins), POWER (6 pins), AFE_CHANNEL_A (5 pins), CURRENT_MONITOR (7 pins), AFE_CHANNEL_B (5 pins)
VCC3V3: USB_FIFO (24 pins), ADC (10 pins), POWER (5 pins), CURRENT_MONITOR (R20.1)
ADC_A_D0: FPGA_MODULE (P1.21), ADC (TP6.1 U2.37)
ADC_A_D1: FPGA_MODULE (P1.20), ADC (TP8.1 U2.38)
ADC_A_D2: FPGA_MODULE (P1.19), ADC (TP11.1 U2.39)
ADC_A_D3: FPGA_MODULE (P1.18), ADC (TP13.1 U2.40)
ADC_A_D4: FPGA_MODULE (P1.17), ADC (TP15.1 U2.41)
ADC_A_D5: FPGA_MODULE (P1.14), ADC (TP17.1 U2.42)
ADC_A_D6: FPGA_MODULE (P1.13), ADC (TP19.1 U2.43)
ADC_A_D7: FPGA_MODULE (P1.12), ADC (TP21.1 U2.44)
ADC_A_ENC: TOP (P5.2), FPGA_MODULE (P2.13), ADC (U2.47)
ADC_A_IN_N: ADC (R30.2 U2.3), AFE_CHANNEL_A (C53_AFE_CHANNEL_A.1)
ADC_A_IN_P: ADC (TP50.1 U2.2), AFE_CHANNEL_A (C50_AFE_CHANNEL_A.1 R38_AFE_CHANNEL_A.1)
ADC_B_D0: FPGA_MODULE (P2.16), ADC (TP7.1 U2.24)
ADC_B_D1: FPGA_MODULE (P2.17), ADC (TP10.1 U2.23)
ADC_B_D2: FPGA_MODULE (P2.18), ADC (TP12.1 U2.22)
ADC_B_D3: FPGA_MODULE (P2.19), ADC (TP14.1 U2.21)
ADC_B_D4: FPGA_MODULE (P2.20), ADC (TP16.1 U2.20)
ADC_B_D5: FPGA_MODULE (P2.21), ADC (TP18.1 U2.19)
ADC_B_D6: FPGA_MODULE (P2.22), ADC (TP20.1 U2.18)
ADC_B_D7: FPGA_MODULE (P2.23), ADC (TP49.1 U2.17)
ADC_B_ENC: TOP (P7.2), FPGA_MODULE (P1.3), ADC (U2.14)
ADC_B_IN_N: ADC (R31.2 U2.10), AFE_CHANNEL_B (C53_AFE_CHANNEL_B.1)
ADC_B_IN_P: ADC (TP51.1 U2.11), AFE_CHANNEL_B (C50_AFE_CHANNEL_B.1 R38_AFE_CHANNEL_B.1)
ADC_DFS: TOP (P8.2), ADC (R34.2 U2.4)
ADC_S1: TOP (P8.3), ADC (R32.2 U2.8)
ADC_S2: TOP (P8.4), ADC (R33.2 U2.9)
FPGA_ADC0: FPGA_MODULE (P1.15), CURRENT_MONITOR (U7.12)
FPGA_ADC1: FPGA_MODULE (P1.16), CONNECTORS (C35.2 R22.2 TP9.1)
FTDI_AC7: USB_FIFO (U1.31), FPGA_MODULE (P1.4 TP33.1)
FTDI_AC8: USB_FIFO (U1.32), FPGA_MODULE (P1.2 TP34.1)
FTDI_AC9: USB_FIFO (U1.33), FPGA_MODULE (P1.1 TP35.1)
FTDI_AD0: USB_FIFO (U1.13), FPGA_MODULE (P2.8 TP37.1)
FTDI_AD1: USB_FIFO (U1.14), FPGA_MODULE (P2.7 TP38.1)
FTDI_AD2: USB_FIFO (U1.15), FPGA_MODULE (P2.6 TP39.1)
FTDI_AD3: USB_FIFO (U1.16), FPGA_MODULE (P2.5 TP40.1)
FTDI_AD4: USB_FIFO (U1.17), FPGA_MODULE (P2.4 TP41.1)
FTDI_AD5: USB_FIFO (U1.18), FPGA_MODULE (P2.3 TP42.1)
FTDI_AD6: USB_FIFO (U1.19), FPGA_MODULE (P2.2 TP43.1)
FTDI_AD7: USB_FIFO (U1.20), FPGA_MODULE (P2.1 TP44.1)
FTDI_CLK_OUT: USB_FIFO (R26.2), FPGA_MODULE (P2.9 TP29.1)
FTDI_OE_n: USB_FIFO (U1.30), FPGA_MODULE (P1.5 TP32.1)
FTDI_RD_n: USB_FIFO (U1.26), FPGA_MODULE (P1.10 TP27.1)
FTDI_RXF_n: USB_FIFO (U1.21), FPGA_MODULE (P1.11 TP31.1)
FTDI_TXE_n: USB_FIFO (U1.25), FPGA_MODULE (P2.10 TP28.1)
FTDI_WR_n: USB_FIFO (U1.27), FPGA_MODULE (P1.9 TP30.1)
SIGA: CONNECTORS (C9.2 J1.1 R27.2 TP24.1), AFE_CHANNEL_A (R35_AFE_CHANNEL_A.1 R36_AFE_CHANNEL_A.1)
SIGB: CONNECTORS (C28.2 J4.1 R29.2 TP5.1), AFE_CHANNEL_B (R35_AFE_CHANNEL_B.1 R36_AFE_CHANNEL_B.1)
SIWU_n: USB_FIFO (R15.2), FPGA_MODULE (P1.8 TP36.1)
USB_D_N: USB_FIFO (U1.6), CONNECTORS (R1.2)
USB_D_P: USB_FIFO (U1.7), CONNECTORS (R2.2)
VBUS_USB: FPGA_MODULE (R5.1), CONNECTORS (7 pins), POWER (C5.2 U5.3), AFE_CHANNEL_A (C52_AFE_CHANNEL_A.2 R42_AFE_CHANNEL_A.2 U3_AFE_CHANNEL_A.3), CURRENT_MONITOR (6 pins), AFE_CHANNEL_B (C52_AFE_CHANNEL_B.2 R42_AFE_CHANNEL_B.2 U3_AFE_CHANNEL_B.3)

## Assembly variants
BUILD: not fitted P1 P2 P3 P4 P5 P6 P8 P9 P? R30 R31 R? R? R? R?_AFE_CHANNEL_A R?_AFE_CHANNEL_A R?_AFE_CHANNEL_B R?_AFE_CHANNEL_B